# EAGLE design BollardsAux (EAGLE 7.5.0)
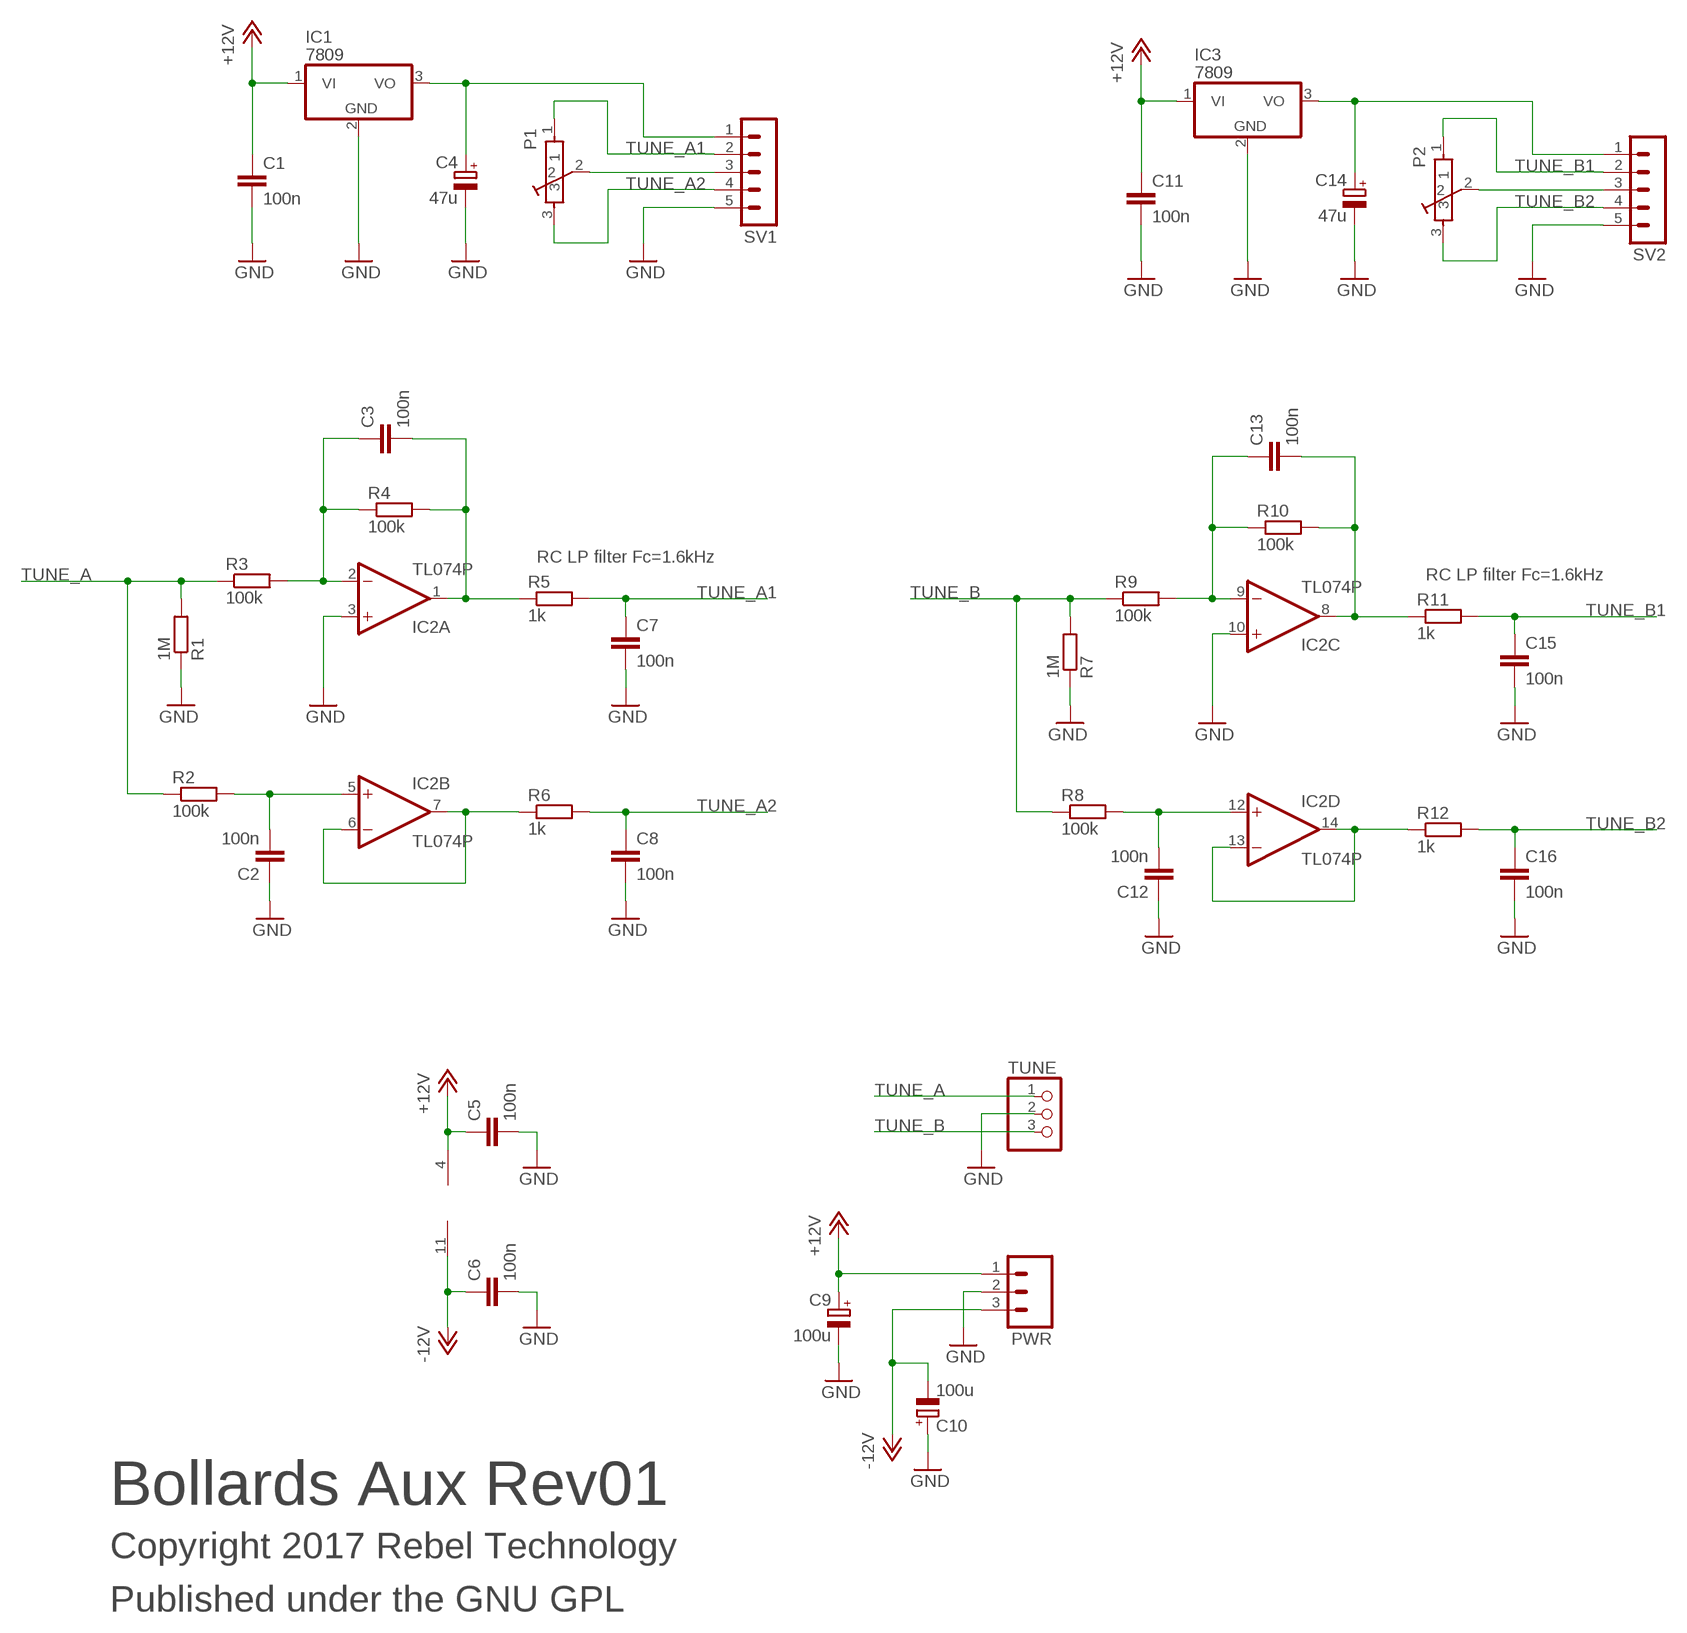
[diagram p0: schematic, sheet 1]

## Parts
C1  100n  C-EU050-025X075  [C050-025X075]
C2  100n  C-EU050-025X075  [C050-025X075]
C3  100n  C-EU050-025X075  [C050-025X075]
C4  47u  CPOL-EUE2.5-7  [E2,5-7]
C5  100n  C-EU050-025X075  [C050-025X075]
C6  100n  C-EU050-025X075  [C050-025X075]
C7  100n  C-EU050-025X075  [C050-025X075]
C8  100n  C-EU050-025X075  [C050-025X075]
C9  100u  CPOL-EUE2.5-7  [E2,5-7]
C10  100u  CPOL-EUE2.5-7  [E2,5-7]
C11  100n  C-EU050-025X075  [C050-025X075]
C12  100n  C-EU050-025X075  [C050-025X075]
C13  100n  C-EU050-025X075  [C050-025X075]
C14  47u  CPOL-EUE2.5-7  [E2,5-7]
C15  100n  C-EU050-025X075  [C050-025X075]
C16  100n  C-EU050-025X075  [C050-025X075]
IC1  7809  7805T  [TO220H]
IC2  TL074P  [DIL14]
IC3  7809  7805T  [TO220H]
P1  100k  POT-BOURNS-PTD901  [POT-BOURNS-PTD901]
P2  100k  POT-BOURNS-PTD901  [POT-BOURNS-PTD901]
PWR  M03PTH  [1X03]
R1  1M  R-EU_0204/7  [0204/7]
R2  100k  R-EU_0204/7  [0204/7]
R3  100k  R-EU_0204/7  [0204/7]
R4  100k  R-EU_0204/7  [0204/7]
R5  1k  R-EU_0204/7  [0204/7]
R6  1k  R-EU_0204/7  [0204/7]
R7  1M  R-EU_0204/7  [0204/7]
R8  100k  R-EU_0204/7  [0204/7]
R9  100k  R-EU_0204/7  [0204/7]
R10  100k  R-EU_0204/7  [0204/7]
R11  1k  R-EU_0204/7  [0204/7]
R12  1k  R-EU_0204/7  [0204/7]
SV1  MA05-1  [MA05-1]
SV2  MA05-1  [MA05-1]
TUNE  CON-JST-1X03PH-TH  [JST-B3B-PH-KL]

## Nets
+12V: C1.1 C5.1 C9.+ C11.1 IC1.1(VI) IC2.4(P:V+) IC3.1(VI) PWR.1
-12V: C6.1 C10.- IC2.11(P:V-) PWR.3
GND: C1.2 C2.1 C4.- C5.2 C6.2 C7.2 C8.2 C9.- C10.+ C11.2 C12.1 C14.- C15.2 C16.2 IC1.2(GND) IC2.3(A:+IN) IC2.10(C:+IN) IC3.2(GND) PWR.2 R1.1 R7.1 SV1.5 SV2.5 TUNE.2
N$1: C2.2 IC2.5(B:+IN) R2.2
N$2: C4.+ IC1.3(VO) SV1.1
N$3: P1.2 SV1.3
N$4: C13.1 IC2.9(C:-IN) R9.2 R10.1
N$5: C13.2 IC2.8(C:OUT) R10.2 R11.1
N$6: IC2.6(B:-IN) IC2.7(B:OUT) R6.1
N$7: C14.+ IC3.3(VO) SV2.1
N$8: P2.2 SV2.3
N$9: C12.2 IC2.12(D:+IN) R8.2
N$10: IC2.13(D:-IN) IC2.14(D:OUT) R12.1
N$38: C3.1 IC2.2(A:-IN) R3.2 R4.1
N$40: C3.2 IC2.1(A:OUT) R4.2 R5.1
TUNE_A: R1.2 R2.1 R3.1 TUNE.1
TUNE_A1: C7.1 P1.1 R5.2 SV1.2
TUNE_A2: C8.1 P1.3 R6.2 SV1.4
TUNE_B: R7.2 R8.1 R9.1 TUNE.3
TUNE_B1: C15.1 P2.1 R11.2 SV2.2
TUNE_B2: C16.1 P2.3 R12.2 SV2.4

## Notes on the sheet
- RC LP filter Fc=1.6kHz
- RC LP filter Fc=1.6kHz
- Bollards Aux Rev01
- Copyright 2017 Rebel Technology
- Published under the GNU GPL

## Library data of the parts
C1-C3 C5-C8 C11-C13 C15 C16 = rcl:C-EU: CAPACITOR, European symbol
C4 C9 C10 C14 = rcl:CPOL-EU: POLARIZED CAPACITOR, European symbol
IC1 IC3 = linear:78*: Positive VOLTAGE REGULATOR Source: http://cache.national.com/ds/LM/LM78L05.pdf http://www.fairchildsemi.com/ds/LM/LM7805.pdf
IC2 = linear:TL074: OP AMP
P1 P2 = Rebel:POT-BOURNS-PTD901
PWR = SparkFun:M03: Header 3 Standard 3-pin 0.1" header. Use with straight break away headers (SKU : PRT-00116), right angle break away headers (PRT-00553), swiss pins (PRT-00743), machine pins (PRT-00117), and female headers (PRT-00115). Molex polarized connector foot print use with SKU : PRT-08232 with associated crimp pins and housings.
R1-R12 = Rebel:R-EU_: RESISTOR, European symbol
SV1 SV2 = con-lstb:MA05-1: PIN HEADER; OC_FARNELL: unknown; OC_NEWARK: unknown
TUNE = Rebel:CON-JST-1X03

## Board
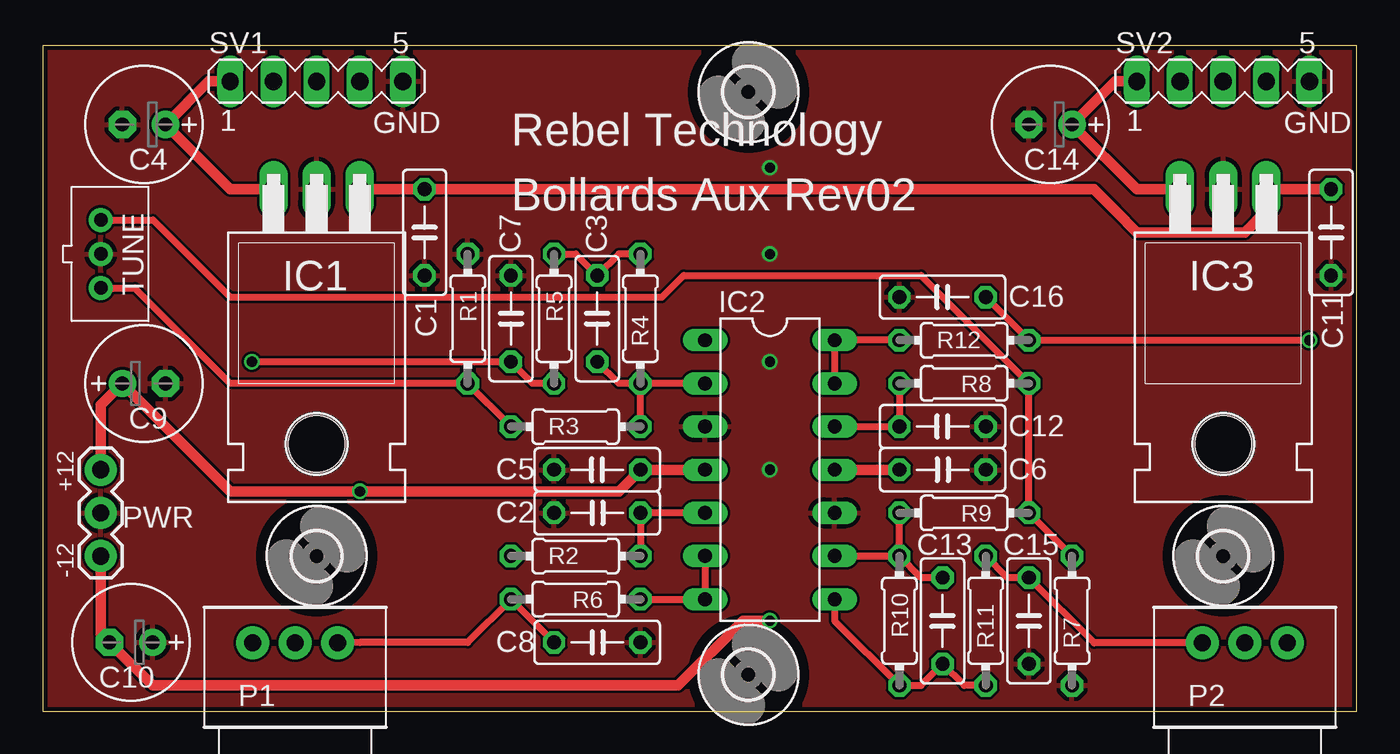
[diagram p1: board, top side]
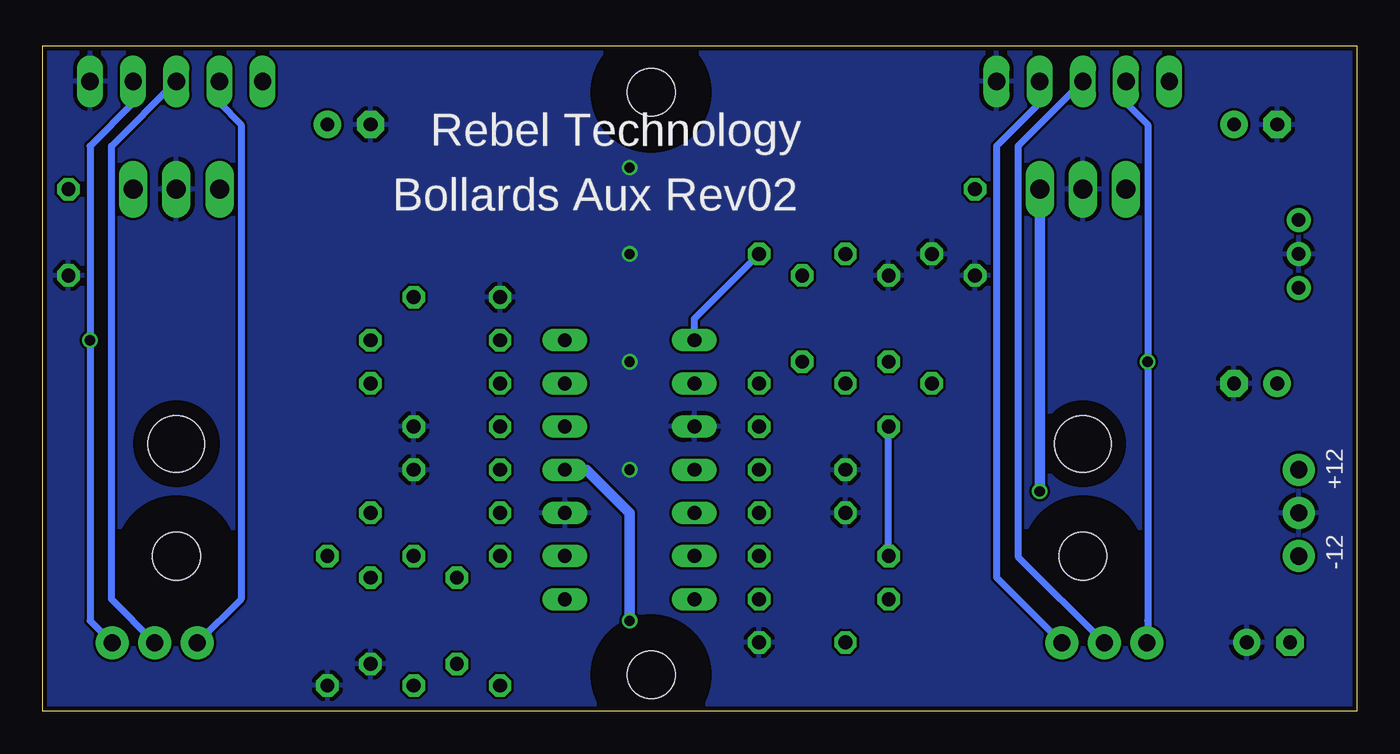
[diagram p2: board, bottom side, seen from below]

Size 77.34 x 39.18 mm. Coordinates in mm from the lower left corner, seen from the top.
Outline: 0,0 77.34,0 77.34,39.18 0,39.18 0,0
Copper layers (1*16): Top 0.035mm / dielectric 1.5mm / Bottom 0.035mm
Design rules "Rebel *": minimum track width 6mil, minimum drill 12mil, track to track 6mil, track to pad 6mil, pad to pad 6mil, via to via 6mil, smd to smd 0mil, copper to edge 10mil, drill to drill 10mil, minimum pad ring 10mil, minimum via ring 6mil, stop-mask expansion 2mil, vias tented up to drill 100mil, thermal gap 10mil

### Footprints (pad centres in the part's own frame; a part is rotated, then mirrored left to right if it is on the bottom)
C050-025X075 = drill 0.813 octagon: 1 -2.54,0; 2 2.54,0
E2,5-7 = drill 0.813 pad 1.6: + -1.27,0 | drill 0.813 pad 1.6 octagon: - 1.27,0
TO220H = drill 1.118 long: 1 -2.54,-10.16; 2 0,-10.16; 3 2.54,-10.16 | hole 3.302: 0,4.826
DIL14 = drill 0.813 long: 1 -7.62,-3.81; 2 -5.08,-3.81; 3 -2.54,-3.81; 4 0,-3.81; 5 2.54,-3.81; 6 5.08,-3.81; 7 7.62,-3.81; 8 7.62,3.81; 9 5.08,3.81; 10 2.54,3.81; 11 0,3.81; 12 -2.54,3.81; 13 -5.08,3.81; 14 -7.62,3.81
POT-BOURNS-PTD901 = drill 1 pad 1.93: 1 -2.5,-0.036; 2 0,-0.036; 3 2.5,-0.036
1X03 = drill 1.016 pad 1.88: 1 0,0; 2 2.54,0; 3 5.08,0
0204/7 = drill 0.813 octagon: 1 -3.81,0; 2 3.81,0
MA05-1 = drill 1.016 long: 1 -5.08,0; 2 -2.54,0; 3 0,0; 4 2.54,0; 5 5.08,0
JST-B3B-PH-KL = drill 0.8 pad 1.422: 1 2,0; 2 0,0; 3 -2,0
2,8 = hole 2.8: 0,0

### Placement (x,y rotation side)
C1  22.48,28.19 270 top
C2  32.64,11.68 0 top
C3  32.64,23.11 90 top
C4  5.97,34.54 180 top
C5  32.64,14.22 180 top
C6  52.96,14.22 0 top
C7  27.56,23.11 90 top
C8  32.64,4.06 0 top
C9  5.97,19.3 0 top
C10  5.21,4.06 180 top
C11  75.82,28.19 270 top
C12  52.96,16.76 180 top
C13  52.96,5.33 270 top
C14  59.31,34.54 180 top
C15  58.04,5.33 270 top
C16  52.96,24.38 180 top
IC1  16.13,20.57 180 top
IC2  42.8,14.22 270 top
IC3  69.47,20.57 180 top
P1  14.86,4.06 0 top
P2  70.74,4.06 0 top
PWR  3.43,14.22 270 top
R1  25.02,23.11 270 top
R2  31.37,9.14 0 top
R3  31.37,16.76 0 top
R4  35.18,23.11 90 top
R5  30.1,23.11 270 top
R6  31.37,6.6 180 top
R7  60.58,5.33 90 top
R8  54.23,19.3 180 top
R9  54.23,11.68 180 top
R10  50.42,5.33 270 top
R11  55.5,5.33 90 top
R12  54.23,21.84 0 top
SV1  16.13,37.08 0 top
SV2  69.47,37.08 0 top
TUNE  3.43,26.92 270 top
U$1  [2,8]  41.53,2.16 0 top
U$3  [2,8]  16.13,9.14 0 top
U$4  [2,8]  41.53,36.45 0 top
U$6  [2,8]  69.47,9.14 0 top

### Tracks (layer width: path | path; a pad name or v marks a point on that pad's centre or on a via)
+12V  (via drill 0.6)
  Top 0.61: IC2.4 C5.1 33.91,12.95 v18.67,12.95 11.05,12.95 C9.+ 3.43,18.03 PWR.1 | IC1.1 C1.1 61.85,30.73 63.12,29.46 64.39,28.19 70.74,28.19 72.01,29.46 IC3.1 C11.1
  Bottom 0.61: v18.67,12.95 IC1.1
-12V  (via drill 0.6)
  Top 0.61: C6.1 IC2.11 | PWR.3 3.43,4.57 C10.- 6.48,1.52 37.4,1.52 41.21,5.33 v42.8,5.33
  Bottom 0.61: v42.8,5.33 42.8,11.68 45.34,14.22 IC2.11
GND  (via drill 0.6)
  other vias: 42.8,26.92 42.8,20.57 42.8,14.22 42.8,32
  pour Bottom: -4.19,-1.65 -4.19,39.62 84.71,39.62 84.71,-1.65
  pour Top: -4.19,-1.65 -4.19,39.62 84.71,39.62 84.71,-1.65
N$1
  Top 0.406: IC2.5 C2.2 R2.2
N$2
  Top 0.61: SV1.1 9.78,37.08 C4.+ 11.05,30.73 IC1.3
N$3
  Bottom 0.406: SV1.3 19.94,33.27 19.94,9.11 P1.2
N$4
  Top 0.406: IC2.9 R10.1 | R10.1 R9.2 | C13.1 51.69,7.87 R10.1
N$5
  Top 0.406: IC2.8 46.61,5.33 R10.2 51.69,1.52 C13.2 54.23,1.52 R11.1
N$6
  Top 0.406: IC2.6 IC2.7 R6.1
N$7
  Top 0.61: SV2.1 63.12,37.08 C14.+ 64.39,30.73 IC3.3
N$8
  Bottom 0.406: P2.2 73.28,6.6 73.28,33.27 SV2.3
N$9
  Top 0.406: R8.2 C12.2 IC2.12
N$10
  Top 0.406: R12.1 IC2.14 IC2.13
N$38
  Top 0.406: IC2.2 R4.1 | R3.2 R4.1 | R4.1 33.91,19.3 C3.1
N$40
  Top 0.406: R5.1 31.37,26.92 C3.2 33.91,26.92 R4.2
  Bottom 0.406: IC2.1 38.99,23.11 R4.2
TUNE_A
  Top 0.406: R3.1 R1.2 11.05,19.3 5.43,24.92 TUNE.1
  Bottom 0.406: R2.1 R3.1
TUNE_A1  (via drill 0.6)
  Top 0.406: R5.2 28.83,19.3 C7.1 v12.32,20.57
  Bottom 0.406: SV1.2 13.59,35.81 12.32,34.54 v12.32,20.57 12.32,5.34 P1.1
TUNE_A2
  Top 0.406: C8.1 R6.2 25.02,4.06 18.66,4.06 P1.3
  Bottom 0.406: SV1.4 18.67,35.81 21.21,33.27 21.21,7.88 P1.3
TUNE_B
  Top 0.406: R7.2 R9.1 R8.1 52.96,24.38 51.69,25.65 37.72,25.65 36.45,24.38 11.05,24.38 6.51,28.92 TUNE.3
TUNE_B1
  Top 0.406: R11.2 56.77,7.87 C15.1 61.88,4.03 P2.1
  Bottom 0.406: SV2.2 66.93,35.81 65.66,34.54 65.66,6.61 P2.1
TUNE_B2  (via drill 0.6)
  Top 0.406: C16.1 R12.2 v74.55,21.84
  Bottom 0.406: SV2.4 72.01,35.81 74.55,33.27 v74.55,21.84 74.55,5.34 P2.3

### Text on the board
tPlace: GND | GND | Rebel Technology | Bollards Aux Rev02 | +12 | -12
bPlace: Rebel Technology | Bollards Aux Rev02 | +12 | -12